# Altium schematic sheet MARS_GPIO_MISC.SchDoc: My title
size A3; Organization: University of California; Address1: 475 Portola Plaza; Address2: Los Angeles, CA 90095; DocumentNumber: 27; Revision: R01; SheetNumber: 27; SheetTotal: 35
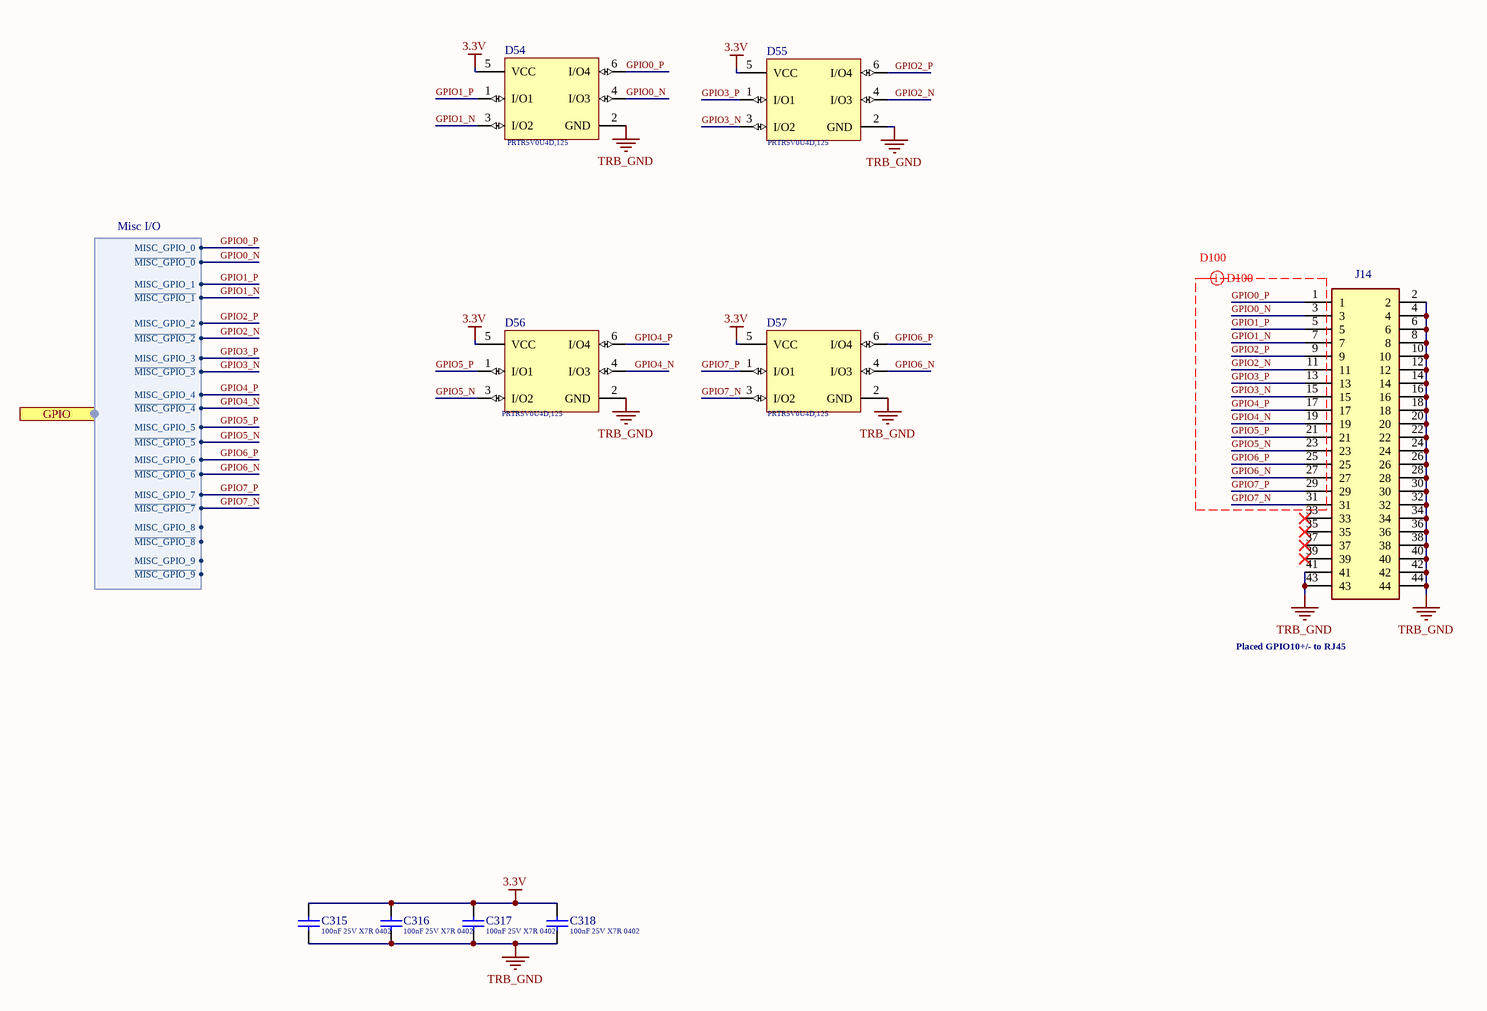
[diagram p0: MARS_GPIO_MISC.SchDoc]

## Parts
C315  Capacitance: 100nF 25V X7R 0402  [Cap_Taiyo_Yuden_TMK105B7104KV-FR_100nF]  (hidden comment: Cap_Taiyo_Yuden_TMK105B7104KV-FR_100nF)
C316  Capacitance: 100nF 25V X7R 0402  [Cap_Taiyo_Yuden_TMK105B7104KV-FR_100nF]  (hidden comment: Cap_Taiyo_Yuden_TMK105B7104KV-FR_100nF)
C317  Capacitance: 100nF 25V X7R 0402  [Cap_Taiyo_Yuden_TMK105B7104KV-FR_100nF]  (hidden comment: Cap_Taiyo_Yuden_TMK105B7104KV-FR_100nF)
C318  Capacitance: 100nF 25V X7R 0402  [Cap_Taiyo_Yuden_TMK105B7104KV-FR_100nF]  (hidden comment: Cap_Taiyo_Yuden_TMK105B7104KV-FR_100nF)
D54  PRTR5V0U4D,125  [PRTR5V0U4D,125]
D55  PRTR5V0U4D,125  [PRTR5V0U4D,125]
D56  PRTR5V0U4D,125  [PRTR5V0U4D,125]
D57  PRTR5V0U4D,125  [PRTR5V0U4D,125]
J14  10-89-7442  [HDRV44W87P254_2X22_5601X508X864P]  (value not drawn)

## Ports
GPIO (harness Misc I/O)

## Harnesses
Misc I/O: MISC_GPIO_0, ~{MISC_GPIO_0}, MISC_GPIO_1, ~{MISC_GPIO_1}, MISC_GPIO_2, ~{MISC_GPIO_2}, MISC_GPIO_3, ~{MISC_GPIO_3}, MISC_GPIO_4, ~{MISC_GPIO_4}, MISC_GPIO_5, ~{MISC_GPIO_5}, MISC_GPIO_6, ~{MISC_GPIO_6}, MISC_GPIO_7, ~{MISC_GPIO_7}, MISC_GPIO_8, ~{MISC_GPIO_8}, MISC_GPIO_9, ~{MISC_GPIO_9}

## Nets
3.3V: C315.2 C316.2 C317.2 C318.2 D54.5(VCC) D55.5(VCC) D56.5(VCC) D57.5(VCC)
TRB_GND: C315.1 C316.1 C317.1 C318.1 D54.2(GND) D55.2(GND) D56.2(GND) D57.2(GND) J14.2 J14.4 J14.6 J14.8 J14.10 J14.12 J14.14 J14.16 J14.18 J14.20 J14.22 J14.24 J14.26 J14.28 J14.30 J14.32 J14.34 J14.36 J14.38 J14.40 J14.41 J14.42 J14.43 J14.44
GPIO0_N: D54.4(I/O3) J14.3 ; port GPIO.~{MISC_GPIO_0}
GPIO0_P: D54.6(I/O4) J14.1 ; port GPIO.MISC_GPIO_0
GPIO1_N: D54.3(I/O2) J14.7 ; port GPIO.~{MISC_GPIO_1}
GPIO1_P: D54.1(I/O1) J14.5 ; port GPIO.MISC_GPIO_1
GPIO2_N: D55.4(I/O3) J14.11 ; port GPIO.~{MISC_GPIO_2}
GPIO2_P: D55.6(I/O4) J14.9 ; port GPIO.MISC_GPIO_2
GPIO3_N: D55.3(I/O2) J14.15 ; port GPIO.~{MISC_GPIO_3}
GPIO3_P: D55.1(I/O1) J14.13 ; port GPIO.MISC_GPIO_3
GPIO4_N: D56.4(I/O3) J14.19 ; port GPIO.~{MISC_GPIO_4}
GPIO4_P: D56.6(I/O4) J14.17 ; port GPIO.MISC_GPIO_4
GPIO5_N: D56.3(I/O2) J14.23 ; port GPIO.~{MISC_GPIO_5}
GPIO5_P: D56.1(I/O1) J14.21 ; port GPIO.MISC_GPIO_5
GPIO6_N: D57.4(I/O3) J14.27 ; port GPIO.~{MISC_GPIO_6}
GPIO6_P: D57.6(I/O4) J14.25 ; port GPIO.MISC_GPIO_6
GPIO7_N: D57.3(I/O2) J14.31 ; port GPIO.~{MISC_GPIO_7}
GPIO7_P: D57.1(I/O1) J14.29 ; port GPIO.MISC_GPIO_7

Not connected (* = marked no-connect by the designer): J14 33* 35* 37* 39*

## Layout directives
differential pair; differential pair class D100: GPIO0_N, GPIO0_P, GPIO1_N, GPIO1_P, GPIO2_N, GPIO2_P, GPIO3_N, GPIO3_P, GPIO4_N, GPIO4_P, GPIO5_N, GPIO5_P, GPIO6_N, GPIO6_P, GPIO7_N, GPIO7_P

## Notes on the sheet
- D100
- Placed GPIO10+/- to RJ45
- 475 Portola Plaza
- GAPS TOF
- igarcia91@g.ucla.edu
- Los Angeles, CA
- 310-825-0344
- Size:
- Date:
- Letter
- Revision:
- Time:
- Sheet
- of
- andrew.peck@cern.ch
- spq@ucla.edu
- File:

## Library data of the parts
C315-C318 = Cap_Taiyo_Yuden_TMK105B7104KV-FR_100nF: CAP CER 100nF 25V X7R 0402; Supplier 1: Mouser; Supplier Part Number 1: 963-TMK105B7104KV-FR
D54-D57 = PRTR5V0U4D,125: ESD Suppressors / TVS Diodes 5.5V QUAD R-R ESD ULTRA LOW CAP; Supplier 1: Mouser; Supplier Part Number 1: 771-PRTR5V0U4D-T/R
J14 = 10-89-7442: Connector; Manufacturer_Name: Molex; Datasheet Link: https://componentsearchengine.com//10-89-7442.pdf; Height: 8.64mm; Mouser2 Part Number: 538-10-89-7442; Mouser2 Price/Stock: https://www.mouser.com/Search/Refine.aspx?Keyword=538-10-89-7442; Manufacturer_Part_Number: 10-89-7442